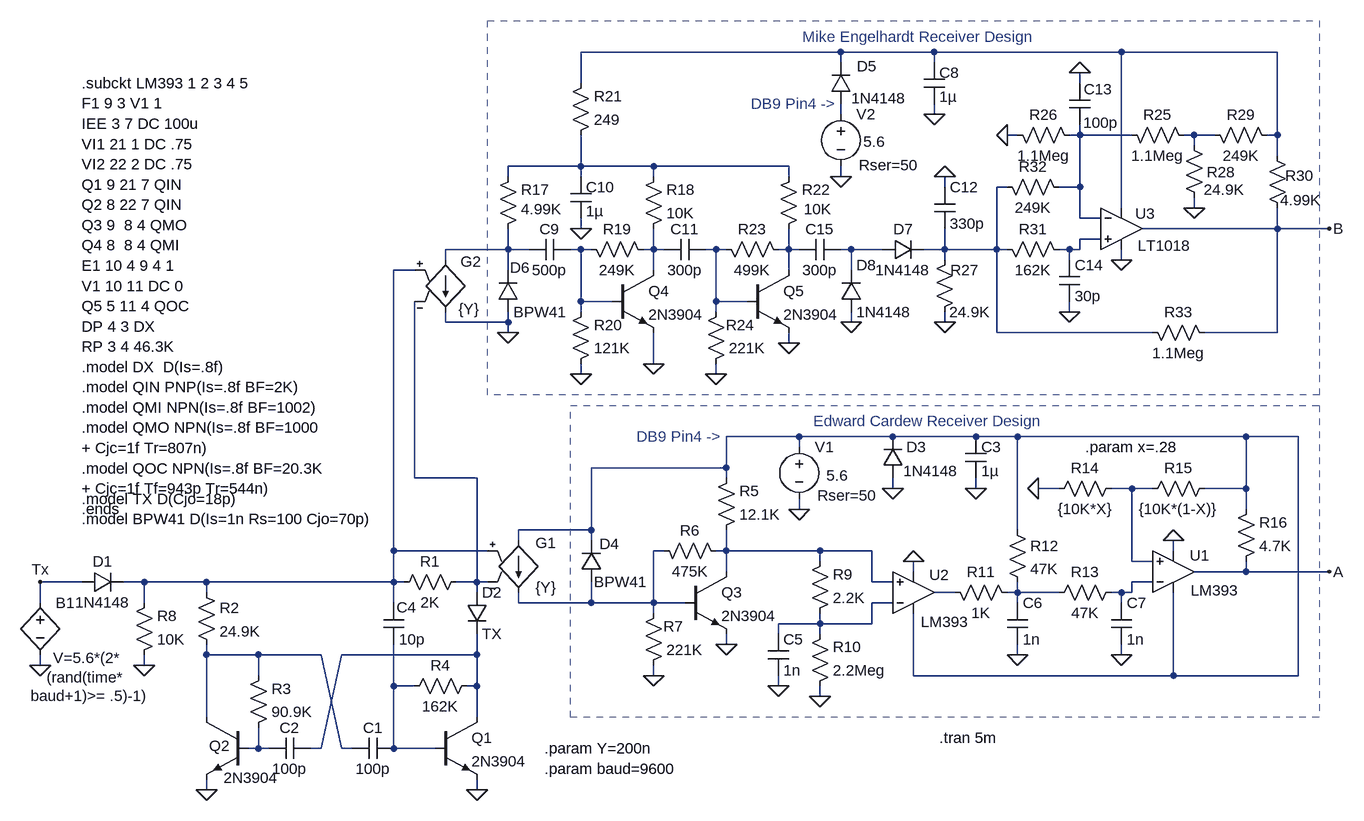
[diagram p0: schematic Timing.asc]
Timing.asc, the LTspice schematic file:
Version 4
SHEET 1 1516 1092
WIRE -144 -672 -544 -672
WIRE 0 -672 -144 -672
WIRE 288 -672 0 -672
WIRE 528 -672 288 -672
WIRE -144 -656 -144 -672
WIRE 0 -656 0 -672
WIRE -544 -624 -544 -672
WIRE 224 -624 224 -640
WIRE -144 -576 -144 -592
WIRE 0 -576 0 -592
WIRE 128 -544 112 -544
WIRE 224 -544 224 -560
WIRE 224 -544 208 -544
WIRE 304 -544 224 -544
WIRE 400 -544 384 -544
WIRE 432 -544 400 -544
WIRE 528 -544 528 -672
WIRE 528 -544 512 -544
WIRE 400 -528 400 -544
WIRE 528 -512 528 -544
WIRE -544 -496 -544 -544
WIRE -544 -496 -656 -496
WIRE -432 -496 -544 -496
WIRE -224 -496 -432 -496
WIRE -656 -480 -656 -496
WIRE -544 -480 -544 -496
WIRE -432 -480 -432 -496
WIRE -224 -480 -224 -496
WIRE -144 -480 -144 -496
WIRE 16 -464 16 -480
WIRE 112 -464 96 -464
WIRE 224 -464 224 -544
WIRE 224 -464 192 -464
WIRE 288 -432 288 -672
WIRE 400 -432 400 -448
WIRE 224 -416 224 -464
WIRE 256 -416 224 -416
WIRE -544 -400 -544 -416
WIRE 528 -400 528 -432
WIRE 528 -400 320 -400
WIRE 608 -400 528 -400
WIRE 256 -384 224 -384
WIRE -656 -368 -656 -400
WIRE -656 -368 -752 -368
WIRE -624 -368 -656 -368
WIRE -544 -368 -560 -368
WIRE -528 -368 -544 -368
WIRE -432 -368 -432 -400
WIRE -432 -368 -448 -368
WIRE -416 -368 -432 -368
WIRE -336 -368 -352 -368
WIRE -320 -368 -336 -368
WIRE -224 -368 -224 -400
WIRE -224 -368 -240 -368
WIRE -208 -368 -224 -368
WIRE -128 -368 -144 -368
WIRE -80 -368 -128 -368
WIRE 16 -368 16 -400
WIRE 16 -368 -16 -368
WIRE 96 -368 96 -464
WIRE 96 -368 16 -368
WIRE 112 -368 96 -368
WIRE 208 -368 192 -368
WIRE 224 -368 224 -384
WIRE 224 -368 208 -368
WIRE -752 -352 -752 -368
WIRE 16 -352 16 -368
WIRE 208 -352 208 -368
WIRE 288 -352 288 -368
WIRE -800 -336 -832 -336
WIRE -656 -336 -656 -368
WIRE -432 -336 -432 -368
WIRE -224 -336 -224 -368
WIRE -128 -336 -128 -368
WIRE -544 -288 -544 -368
WIRE -496 -288 -544 -288
WIRE -336 -288 -336 -368
WIRE -288 -288 -336 -288
WIRE -544 -272 -544 -288
WIRE -336 -272 -336 -288
WIRE 208 -272 208 -288
WIRE -752 -256 -752 -272
WIRE -656 -256 -656 -272
WIRE -656 -256 -752 -256
WIRE -128 -256 -128 -272
WIRE 16 -256 16 -272
WIRE -656 -240 -656 -256
WIRE 96 -240 96 -368
WIRE 336 -240 96 -240
WIRE 528 -240 528 -400
WIRE 528 -240 416 -240
WIRE -224 -224 -224 -240
WIRE -432 -192 -432 -240
WIRE -544 -176 -544 -192
WIRE -336 -176 -336 -192
WIRE -208 -80 -320 -80
WIRE -64 -80 -208 -80
WIRE 64 -80 -64 -80
WIRE 128 -80 64 -80
WIRE 480 -80 128 -80
WIRE 560 -80 480 -80
WIRE -208 -64 -208 -80
WIRE -320 -32 -320 -80
WIRE -320 -32 -528 -32
WIRE -800 -16 -800 -288
WIRE -704 -16 -800 -16
WIRE -320 -16 -320 -32
WIRE -64 0 -64 -16
WIRE 64 0 64 -16
WIRE 192 0 160 0
WIRE 304 0 272 0
WIRE 336 0 304 0
WIRE 480 0 480 -80
WIRE 480 0 416 0
WIRE -208 32 -208 16
WIRE 480 32 480 0
WIRE -528 64 -528 -32
WIRE -528 64 -640 64
WIRE 128 64 128 -80
WIRE -640 80 -640 64
WIRE -528 80 -528 64
WIRE -832 96 -832 -336
WIRE -688 96 -832 96
WIRE -416 96 -432 96
WIRE -320 96 -320 64
WIRE -320 96 -336 96
WIRE -176 96 -320 96
WIRE -96 96 -176 96
WIRE 368 96 368 80
WIRE -176 112 -176 96
WIRE 304 112 304 0
WIRE 336 112 304 112
WIRE -320 128 -320 96
WIRE -32 128 -32 112
WIRE 480 128 480 112
WIRE 480 128 400 128
WIRE 608 128 480 128
WIRE -1312 144 -1376 144
WIRE -1216 144 -1248 144
WIRE -1120 144 -1216 144
WIRE -832 144 -832 96
WIRE -832 144 -1120 144
WIRE -816 144 -832 144
WIRE -704 144 -704 -16
WIRE -704 144 -736 144
WIRE -688 144 -704 144
WIRE -96 144 -96 96
WIRE -64 144 -96 144
WIRE 336 144 304 144
WIRE -1120 160 -1120 144
WIRE -704 160 -704 144
WIRE 32 160 0 160
WIRE 128 160 128 144
WIRE 128 160 112 160
WIRE 192 160 128 160
WIRE 288 160 272 160
WIRE 304 160 304 144
WIRE 304 160 288 160
WIRE -1376 176 -1376 144
WIRE -1216 176 -1216 144
WIRE -832 176 -832 144
WIRE -640 176 -640 160
WIRE -528 176 -528 144
WIRE -528 176 -640 176
WIRE -432 176 -432 96
WIRE -432 176 -528 176
WIRE -384 176 -432 176
WIRE -64 176 -96 176
WIRE 128 176 128 160
WIRE 288 176 288 160
WIRE -432 192 -432 176
WIRE -176 208 -176 192
WIRE -176 208 -240 208
WIRE -96 208 -96 176
WIRE -96 208 -176 208
WIRE -240 224 -240 208
WIRE -176 224 -176 208
WIRE -320 240 -320 224
WIRE -1120 256 -1120 240
WIRE -1040 256 -1120 256
WIRE -944 256 -1040 256
WIRE -704 256 -704 224
WIRE -704 256 -912 256
WIRE 128 256 128 240
WIRE 288 256 288 240
WIRE -1376 272 -1376 256
WIRE -1216 272 -1216 256
WIRE -1040 288 -1040 256
WIRE -432 288 -432 272
WIRE -32 288 -32 192
WIRE 368 288 368 160
WIRE 368 288 -32 288
WIRE 560 288 560 -80
WIRE 560 288 368 288
WIRE -832 304 -832 240
WIRE -800 304 -832 304
WIRE -704 304 -704 256
WIRE -704 304 -720 304
WIRE -240 304 -240 288
WIRE -176 320 -176 304
WIRE -1120 352 -1120 256
WIRE -704 352 -704 304
WIRE -1040 400 -1040 368
WIRE -1040 400 -1056 400
WIRE -1024 400 -1040 400
WIRE -944 400 -912 256
WIRE -944 400 -960 400
WIRE -912 400 -944 256
WIRE -896 400 -912 400
WIRE -832 400 -832 304
WIRE -768 400 -832 400
WIRE -1120 464 -1120 448
WIRE -704 464 -704 448
FLAG -208 32 0
FLAG -1376 272 0
FLAG 64 0 0
FLAG -320 240 0
FLAG -432 288 0
FLAG -32 112 0
FLAG 608 128 A
FLAG -1120 464 0
FLAG -704 464 0
FLAG -1216 272 0
FLAG -176 320 0
FLAG -240 304 0
FLAG 128 256 0
FLAG 368 80 0
FLAG 288 256 0
FLAG 160 0 0
FLAG -64 0 0
FLAG -1376 144 Tx
FLAG -144 -480 0
FLAG 0 -576 0
FLAG -656 -240 0
FLAG -432 -192 0
FLAG -544 -176 0
FLAG -544 -400 0
FLAG -224 -224 0
FLAG -336 -176 0
FLAG 288 -352 0
FLAG 112 -544 0
FLAG -128 -256 0
FLAG 16 -256 0
FLAG 16 -480 0
FLAG 224 -640 0
FLAG 400 -432 0
FLAG 208 -272 0
FLAG 608 -400 B
SYMBOL voltage -208 -80 R0
WINDOW 3 42 60 Left 0
WINDOW 123 0 0 Left 0
WINDOW 39 28 91 Left 0
SYMATTR Value 5.6
SYMATTR SpiceLine Rser=50
SYMATTR InstName V1
SYMBOL res -832 160 R270
WINDOW 0 32 56 VTop 0
WINDOW 3 0 56 VBottom 0
SYMATTR InstName R1
SYMATTR Value 2K
SYMBOL npn -768 352 R0
SYMATTR InstName Q1
SYMATTR Value 2N3904
SYMBOL npn -1056 352 M0
WINDOW 0 28 44 Left 0
WINDOW 3 38 93 Right 0
SYMATTR InstName Q2
SYMATTR Value 2N3904
SYMBOL res -1136 144 R0
SYMATTR InstName R2
SYMATTR Value 24.9K
SYMATTR SpiceLine tol=1 pwr=0.1
SYMBOL cap -832 384 R90
WINDOW 0 0 32 VBottom 0
WINDOW 3 32 32 VTop 0
SYMATTR InstName C1
SYMATTR Value 100p
SYMBOL cap -960 384 R90
WINDOW 0 0 32 VBottom 0
WINDOW 3 32 32 VTop 0
SYMATTR InstName C2
SYMATTR Value 100p
SYMBOL res -1056 384 M180
WINDOW 0 36 76 Left 0
WINDOW 3 36 40 Left 0
SYMATTR InstName R3
SYMATTR Value 90.9K
SYMBOL res -704 288 R90
WINDOW 0 0 56 VBottom 0
WINDOW 3 32 56 VTop 0
SYMATTR InstName R4
SYMATTR Value 162K
SYMBOL diode -1312 128 M90
WINDOW 0 0 32 VBottom 0
WINDOW 3 32 32 VTop 0
SYMATTR InstName D1
SYMATTR Value 1N4148
SYMBOL cap 48 -80 R0
WINDOW 0 24 16 Left 0
WINDOW 3 24 53 Left 0
SYMATTR InstName C3
SYMATTR Value 1µ
SYMBOL diode -720 160 R0
SYMATTR InstName D2
SYMATTR Value TX
SYMBOL diode -80 -16 M180
WINDOW 0 37 48 Left 0
WINDOW 3 32 11 Left 0
SYMATTR InstName D3
SYMATTR Value 1N4148
SYMBOL diode -544 144 M180
WINDOW 0 29 59 Left 0
WINDOW 3 20 0 Left 0
SYMATTR InstName D4
SYMATTR Value BPW41
SYMBOL g2 -640 176 M180
WINDOW 0 26 92 Left 0
WINDOW 3 26 24 Left 0
SYMATTR InstName G1
SYMATTR Value {Y}
SYMBOL npn -384 128 R0
SYMATTR InstName Q3
SYMATTR Value 2N3904
SYMBOL res -336 80 M180
WINDOW 0 36 76 Left 0
WINDOW 3 36 40 Left 0
SYMATTR InstName R5
SYMATTR Value 12.1K
SYMATTR SpiceLine tol=1 pwr=0.1
SYMBOL res -432 80 M90
WINDOW 0 0 56 VBottom 0
WINDOW 3 32 56 VTop 0
SYMATTR InstName R6
SYMATTR Value 475K
SYMATTR SpiceLine tol=1 pwr=0.1
SYMBOL res -448 288 M180
WINDOW 0 31 76 Left 0
WINDOW 3 36 40 Left 0
SYMATTR InstName R7
SYMATTR Value 221K
SYMATTR SpiceLine tol=1 pwr=0.1
SYMBOL res -1232 272 M180
WINDOW 0 36 76 Left 0
WINDOW 3 36 40 Left 0
SYMATTR InstName R8
SYMATTR Value 10K
SYMATTR SpiceLine tol=1 pwr=0.1
SYMBOL cap -848 240 M180
WINDOW 0 20 57 Left 0
WINDOW 3 24 8 Left 0
SYMATTR InstName C4
SYMATTR Value 10p
SYMBOL res -192 208 M180
WINDOW 0 36 76 Left 0
WINDOW 3 36 40 Left 0
SYMATTR InstName R9
SYMATTR Value 2.2K
SYMATTR SpiceLine tol=1 pwr=0.1
SYMBOL res -192 320 M180
WINDOW 0 36 76 Left 0
WINDOW 3 36 40 Left 0
SYMATTR InstName R10
SYMATTR Value 2.2Meg
SYMATTR SpiceLine tol=1 pwr=0.1
SYMBOL cap -256 224 R0
SYMATTR InstName C5
SYMATTR Value 1n
SYMBOL res 16 144 M90
WINDOW 0 0 56 VBottom 0
WINDOW 3 32 56 VTop 0
SYMATTR InstName R11
SYMATTR Value 1K
SYMATTR SpiceLine tol=1 pwr=0.1
SYMBOL cap 112 240 M180
WINDOW 0 24 64 Left 0
WINDOW 3 24 8 Left 0
SYMATTR InstName C6
SYMATTR Value 1n
SYMBOL res 112 48 R0
SYMATTR InstName R12
SYMATTR Value 47K
SYMATTR SpiceLine tol=1 pwr=0.1
SYMBOL res 288 144 R90
WINDOW 0 0 56 VBottom 0
WINDOW 3 32 56 VTop 0
SYMATTR InstName R13
SYMATTR Value 47K
SYMATTR SpiceLine tol=1 pwr=0.1
SYMBOL cap 272 240 M180
WINDOW 0 24 64 Left 0
WINDOW 3 24 8 Left 0
SYMATTR InstName C7
SYMATTR Value 1n
SYMBOL res 288 -16 R90
WINDOW 0 0 56 VBottom 0
WINDOW 3 32 56 VTop 0
SYMATTR InstName R14
SYMATTR Value {10K*X}
SYMBOL res 432 -16 R90
WINDOW 0 0 56 VBottom 0
WINDOW 3 32 56 VTop 0
SYMATTR InstName R15
SYMATTR Value {10K*(1-X)}
SYMBOL res 464 128 M180
WINDOW 0 36 76 Left 0
WINDOW 3 36 40 Left 0
SYMATTR InstName R16
SYMATTR Value 4.7K
SYMATTR SpiceLine tol=1 pwr=0.1
SYMBOL opamps\\opamp2 368 192 M180
WINDOW 0 25 89 Left 0
WINDOW 3 27 35 Left 0
SYMATTR InstName U1
SYMATTR Value LM393
SYMBOL opamps\\opamp2 -32 224 M180
WINDOW 0 24 91 Left 0
WINDOW 3 11 19 Left 0
SYMATTR InstName U2
SYMATTR Value LM393
SYMBOL bv -1376 160 R0
WINDOW 3 20 101 Left 0
WINDOW 123 10 131 Left 0
WINDOW 39 -15 159 Left 0
SYMATTR Value V=5.6*(2*
SYMATTR Value2 (rand(time*
SYMATTR SpiceLine baud+1)>= .5)-1)
SYMATTR InstName B1
SYMBOL voltage -144 -592 R0
WINDOW 3 35 58 Left 0
WINDOW 123 0 0 Left 0
WINDOW 39 28 94 Left 0
SYMATTR Value 5.6
SYMATTR SpiceLine Rser=50
SYMATTR InstName V2
SYMBOL cap -16 -656 R0
WINDOW 0 24 16 Left 0
WINDOW 3 24 53 Left 0
SYMATTR InstName C8
SYMATTR Value 1µ
SYMBOL diode -160 -592 M180
WINDOW 0 41 58 Left 0
WINDOW 3 32 9 Left 0
SYMATTR InstName D5
SYMATTR Value 1N4148
SYMBOL diode -672 -272 M180
WINDOW 0 19 68 Left 0
WINDOW 3 24 0 Left 0
SYMATTR InstName D6
SYMATTR Value BPW41
SYMBOL g2 -752 -256 M180
WINDOW 0 23 93 Left 0
WINDOW 3 20 20 Left 0
SYMATTR InstName G2
SYMATTR Value {Y}
SYMBOL res -672 -384 M180
WINDOW 0 36 76 Left 0
WINDOW 3 36 46 Left 0
SYMATTR InstName R17
SYMATTR Value 4.99K
SYMATTR SpiceLine tol=1 pwr=0.1
SYMBOL npn -496 -336 R0
SYMATTR InstName Q4
SYMATTR Value 2N3904
SYMBOL res -448 -384 M180
WINDOW 0 36 76 Left 0
WINDOW 3 36 40 Left 0
SYMATTR InstName R18
SYMATTR Value 10K
SYMATTR SpiceLine tol=1 pwr=0.1
SYMBOL res -544 -384 M90
WINDOW 0 0 56 VBottom 0
WINDOW 3 32 56 VTop 0
SYMATTR InstName R19
SYMATTR Value 249K
SYMATTR SpiceLine tol=1 pwr=0.1
SYMBOL res -560 -176 M180
WINDOW 0 36 76 Left 0
WINDOW 3 36 40 Left 0
SYMATTR InstName R20
SYMATTR Value 121K
SYMATTR SpiceLine tol=1 pwr=0.1
SYMBOL cap -560 -352 M270
WINDOW 0 32 32 VTop 0
WINDOW 3 0 32 VBottom 0
SYMATTR InstName C9
SYMATTR Value 500p
SYMBOL cap -560 -480 R0
WINDOW 0 24 16 Left 0
WINDOW 3 24 53 Left 0
SYMATTR InstName C10
SYMATTR Value 1µ
SYMBOL res -560 -528 M180
WINDOW 0 36 76 Left 0
WINDOW 3 36 40 Left 0
SYMATTR InstName R21
SYMATTR Value 249
SYMBOL npn -288 -336 R0
SYMATTR InstName Q5
SYMATTR Value 2N3904
SYMBOL res -240 -384 M180
WINDOW 0 36 76 Left 0
WINDOW 3 39 46 Left 0
SYMATTR InstName R22
SYMATTR Value 10K
SYMATTR SpiceLine tol=1 pwr=0.1
SYMBOL res -336 -384 M90
WINDOW 0 0 56 VBottom 0
WINDOW 3 32 56 VTop 0
SYMATTR InstName R23
SYMATTR Value 499K
SYMATTR SpiceLine tol=1 pwr=0.1
SYMBOL res -352 -176 M180
WINDOW 0 31 76 Left 0
WINDOW 3 36 40 Left 0
SYMATTR InstName R24
SYMATTR Value 221K
SYMATTR SpiceLine tol=1 pwr=0.1
SYMBOL cap -352 -352 M270
WINDOW 0 32 32 VTop 0
WINDOW 3 0 32 VBottom 0
SYMATTR InstName C11
SYMATTR Value 300p
SYMBOL res 400 -528 M270
WINDOW 0 32 56 VTop 0
WINDOW 3 0 56 VBottom 0
SYMATTR InstName R25
SYMATTR Value 1.1Meg
SYMBOL res 224 -528 M270
WINDOW 0 32 56 VTop 0
WINDOW 3 0 56 VBottom 0
SYMATTR InstName R26
SYMATTR Value 1.1Meg
SYMBOL res 0 -256 M180
WINDOW 0 25 80 Left 0
WINDOW 3 23 16 Left 0
SYMATTR InstName R27
SYMATTR Value 24.9K
SYMATTR SpiceLine tol=1 pwr=0.1
SYMBOL cap 0 -400 M180
WINDOW 0 24 64 Left 0
WINDOW 3 24 8 Left 0
SYMATTR InstName C12
SYMATTR Value 330p
SYMBOL cap 208 -624 R0
WINDOW 0 22 9 Left 0
WINDOW 3 21 61 Left 0
SYMATTR InstName C13
SYMATTR Value 100p
SYMBOL res 384 -544 R0
WINDOW 0 35 57 Left 0
WINDOW 3 31 84 Left 0
SYMATTR InstName R28
SYMATTR Value 24.9K
SYMATTR SpiceLine tol=1 pwr=0.1
SYMBOL res 528 -528 M270
WINDOW 0 32 56 VTop 0
WINDOW 3 0 56 VBottom 0
SYMATTR InstName R29
SYMATTR Value 249K
SYMBOL cap 192 -352 R0
SYMATTR InstName C14
SYMATTR Value 30p
SYMBOL cap -144 -352 M270
WINDOW 0 32 32 VTop 0
WINDOW 3 0 32 VBottom 0
SYMATTR InstName C15
SYMATTR Value 300p
SYMBOL diode -80 -352 R270
WINDOW 0 32 32 VTop 0
WINDOW 3 0 32 VBottom 0
SYMATTR InstName D7
SYMATTR Value 1N4148
SYMBOL diode -144 -272 M180
WINDOW 0 24 72 Left 0
WINDOW 3 24 0 Left 0
SYMATTR InstName D8
SYMATTR Value 1N4148
SYMBOL res 512 -528 R0
WINDOW 0 28 46 Left 0
WINDOW 3 20 84 Left 0
SYMATTR InstName R30
SYMATTR Value 4.99K
SYMATTR SpiceLine tol=1 pwr=0.1
SYMBOL res 96 -384 M90
WINDOW 0 0 56 VBottom 0
WINDOW 3 32 56 VTop 0
SYMATTR InstName R31
SYMATTR Value 162K
SYMATTR SpiceLine tol=1 pwr=0.1
SYMBOL Comparators\\LT1018 288 -400 R0
WINDOW 0 21 -23 Left 0
WINDOW 3 25 26 Left 0
SYMATTR InstName U3
SYMBOL res 96 -480 M90
WINDOW 0 0 56 VBottom 0
WINDOW 3 32 56 VTop 0
SYMATTR InstName R32
SYMATTR Value 249K
SYMATTR SpiceLine tol=1 pwr=0.1
SYMBOL res 432 -224 M270
WINDOW 0 32 56 VTop 0
WINDOW 3 0 56 VBottom 0
SYMATTR InstName R33
SYMATTR Value 1.1Meg
TEXT 8 384 Left 0 !.tran 5m
TEXT -600 400 Left 0 !.param Y=200n\n.param baud=9600
TEXT 304 -48 Bottom 0 !.param x=.28
TEXT -8 -88 Bottom 0 ;Edward Cardew Receiver Design
TEXT -1312 -624 Left 0 !.subckt LM393 1 2 3 4 5\nF1 9 3 V1 1\nIEE 3 7 DC 100u\nVI1 21 1 DC .75\nVI2 22 2 DC .75\nQ1 9 21 7 QIN\nQ2 8 22 7 QIN\nQ3 9  8 4 QMO\nQ4 8  8 4 QMI\nE1 10 4 9 4 1\nV1 10 11 DC 0\nQ5 5 11 4 QOC\nDP 4 3 DX\nRP 3 4 46.3K\n.model DX  D(Is=.8f)\n.model QIN PNP(Is=.8f BF=2K)\n.model QMI NPN(Is=.8f BF=1002)\n.model QMO NPN(Is=.8f BF=1000\n+ Cjc=1f Tr=807n)\n.model QOC NPN(Is=.8f BF=20.3K\n+ Cjc=1f Tf=943p Tr=544n)\n.ends
TEXT -1312 16 Left 0 !.model TX D(Cjo=18p)\n.model BPW41 D(Is=1n Rs=100 Cjo=70p)
TEXT -24 -680 Bottom 0 ;Mike Engelhardt Receiver Design
TEXT -152 -592 Right 0 ;DB9 Pin4 ->
TEXT -328 -80 Right 0 ;DB9 Pin4 ->
RECTANGLE Normal 592 352 -560 -128 2
RECTANGLE Normal 592 -144 -688 -720 2

The netlist it stands for:
* Timing.asc
V1 N015 0 5.6 Rser=50
R1 N014 N016 2K
Q1 N025 N026 0 0 2N3904
Q2 N024 N027 0 0 2N3904
R2 N014 N024 24.9K tol=1 pwr=0.1
C1 N026 N024 100p
C2 N025 N027 100p
R3 N027 N024 90.9K
R4 N025 N026 162K
D1 Tx N014 1N4148
C3 N015 0 1µ
D2 N016 N025 TX
D3 0 N015 1N4148
D4 N018 N015 BPW41
G1 N015 N018 N014 N016 {Y}
Q3 N019 N018 0 0 2N3904
R5 N019 N015 12.1K tol=1 pwr=0.1
R6 N018 N019 475K tol=1 pwr=0.1
R7 0 N018 221K tol=1 pwr=0.1
R8 0 N014 10K tol=1 pwr=0.1
C4 N026 N014 10p
R9 N023 N019 2.2K tol=1 pwr=0.1
R10 0 N023 2.2Meg tol=1 pwr=0.1
C5 N023 0 1n
R11 N021 N022 1K tol=1 pwr=0.1
C6 0 N022 1n
R12 N015 N022 47K tol=1 pwr=0.1
R13 N020 N022 47K tol=1 pwr=0.1
C7 0 N020 1n
R14 N017 0 {10K*X}
R15 N015 N017 {10K*(1-X)}
R16 A N015 4.7K tol=1 pwr=0.1
XU1 N017 N020 N015 0 A LM393  ; pins In+ In- V+ V- OUT
XU2 N019 N023 N015 0 N021 LM393  ; pins In+ In- V+ V- OUT
B1 Tx 0 V=5.6*(2* (rand(time* baud+1)>= .5)-1)
V2 N002 0 5.6 Rser=50
C8 N001 0 1µ
D5 N002 N001 1N4148
D6 0 N008 BPW41
G2 N008 0 N014 N016 {Y}
R17 N008 N005 4.99K tol=1 pwr=0.1
Q4 N010 N009 0 0 2N3904
R18 N010 N005 10K tol=1 pwr=0.1
R19 N009 N010 249K tol=1 pwr=0.1
R20 0 N009 121K tol=1 pwr=0.1
C9 N009 N008 500p
C10 N005 0 1µ
R21 N005 N001 249
Q5 N012 N011 0 0 2N3904
R22 N012 N005 10K tol=1 pwr=0.1
R23 N011 N012 499K tol=1 pwr=0.1
R24 0 N011 221K tol=1 pwr=0.1
C11 N011 N010 300p
R25 N004 N003 1.1Meg
R26 N003 0 1.1Meg
R27 0 N006 24.9K tol=1 pwr=0.1
C12 N006 0 330p
C13 0 N003 100p
R28 N004 0 24.9K tol=1 pwr=0.1
R29 N001 N004 249K
C14 N007 0 30p
C15 N013 N012 300p
D7 N013 N006 1N4148
D8 0 N013 1N4148
R30 N001 B 4.99K tol=1 pwr=0.1
R31 N006 N007 162K tol=1 pwr=0.1
XU3 N007 N003 N001 0 B LT1018  ; pins In+ In- V+ V- OUT
R32 N006 N003 249K tol=1 pwr=0.1
R33 B N006 1.1Meg
.model D D
.lib standard.dio
.model NPN NPN
.model PNP PNP
.lib standard.bjt
.tran 5m
.param Y=200n
.param baud=9600
.param x=.28
* Edward Cardew Receiver Design
.subckt LM393 1 2 3 4 5
F1 9 3 V1 1
IEE 3 7 DC 100u
VI1 21 1 DC .75
VI2 22 2 DC .75
Q1 9 21 7 QIN
Q2 8 22 7 QIN
Q3 9  8 4 QMO
Q4 8  8 4 QMI
E1 10 4 9 4 1
V1 10 11 DC 0
Q5 5 11 4 QOC
DP 4 3 DX
RP 3 4 46.3K
.model DX  D(Is=.8f)
.model QIN PNP(Is=.8f BF=2K)
.model QMI NPN(Is=.8f BF=1002)
.model QMO NPN(Is=.8f BF=1000
+ Cjc=1f Tr=807n)
.model QOC NPN(Is=.8f BF=20.3K
+ Cjc=1f Tf=943p Tr=544n)
.ends
.model TX D(Cjo=18p)
.model BPW41 D(Is=1n Rs=100 Cjo=70p)
* Mike Engelhardt Receiver Design
* DB9 Pin4 ->
* DB9 Pin4 ->
.lib LTC1.lib
.backanno
.end